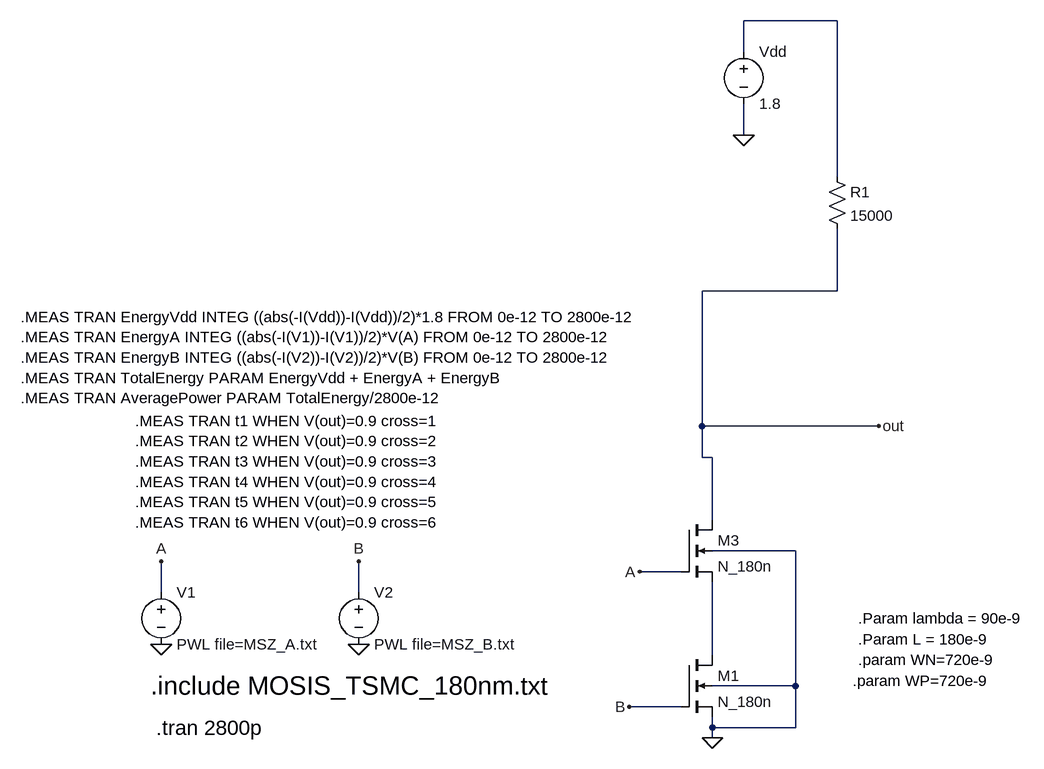
[diagram p0: schematic NAND2_180nm.asc]
NAND2_180nm.asc, the LTspice schematic file:
Version 4
SHEET 1 880 680
WIRE -912 -752 -1056 -752
WIRE -1056 -704 -1056 -752
WIRE -1056 -576 -1056 -624
WIRE -912 -512 -912 -752
WIRE -912 -336 -912 -432
WIRE -912 -336 -1120 -336
WIRE -1120 -128 -1120 -336
WIRE -848 -128 -1120 -128
WIRE -1120 -80 -1120 -128
WIRE -1104 -80 -1120 -80
WIRE -1104 16 -1104 -80
WIRE -976 64 -1104 64
WIRE -1152 96 -1216 96
WIRE -1952 128 -1952 80
WIRE -1648 128 -1648 80
WIRE -1104 224 -1104 112
WIRE -976 272 -976 64
WIRE -976 272 -1104 272
WIRE -1152 304 -1232 304
WIRE -1104 336 -1104 320
WIRE -976 336 -976 272
WIRE -976 336 -1104 336
WIRE -1104 352 -1104 336
FLAG -1952 208 0
FLAG -1648 208 0
FLAG -1952 80 A
FLAG -1648 80 B
FLAG -1104 352 0
FLAG -848 -128 out
FLAG -1232 304 B
FLAG -1216 96 A
FLAG -1056 -576 0
SYMBOL voltage -1952 112 R0
WINDOW 123 0 0 Left 0
WINDOW 39 0 0 Left 0
SYMATTR InstName V1
SYMATTR Value PWL file=MSZ_A.txt
SYMBOL voltage -1648 112 R0
WINDOW 123 0 0 Left 0
WINDOW 39 0 0 Left 0
SYMATTR InstName V2
SYMATTR Value PWL file=MSZ_B.txt
SYMBOL nmos4 -1152 224 R0
SYMATTR InstName M1
SYMATTR Value N_180n
SYMATTR Value2 l={L} w={WN} ad={5*lambda*WN} as={5*lambda*WN} pd={10*lambda + 2*WN} ps={10*lambda + 2*WN}
SYMBOL voltage -1056 -720 R0
SYMATTR InstName Vdd
SYMATTR Value 1.8
SYMBOL nmos4 -1152 16 R0
SYMATTR InstName M3
SYMATTR Value N_180n
SYMATTR Value2 l={L} w={WN} ad={5*lambda*WN} as={5*lambda*WN} pd={10*lambda + 2*WN} ps={10*lambda + 2*WN}
SYMBOL res -928 -528 R0
SYMATTR InstName R1
SYMATTR Value 15000
TEXT -1960 336 Left 3 !.tran 2800p
TEXT -1968 272 Left 4 !.include MOSIS_TSMC_180nm.txt
TEXT -880 168 Left 2 !.Param lambda = 90e-9
TEXT -880 200 Left 2 !.Param L = 180e-9
TEXT -880 232 Left 2 !.param WN=720e-9
TEXT -888 264 Left 2 !.param WP=720e-9
TEXT -1992 -136 Left 2 !.MEAS TRAN t1 WHEN V(out)=0.9 cross=1\n.MEAS TRAN t2 WHEN V(out)=0.9 cross=2\n.MEAS TRAN t3 WHEN V(out)=0.9 cross=3\n.MEAS TRAN t4 WHEN V(out)=0.9 cross=4\n.MEAS TRAN t5 WHEN V(out)=0.9 cross=5\n.MEAS TRAN t6 WHEN V(out)=0.9 cross=6
TEXT -2168 -296 Left 2 !.MEAS TRAN EnergyVdd INTEG ((abs(-I(Vdd))-I(Vdd))/2)*1.8 FROM 0e-12 TO 2800e-12\n.MEAS TRAN EnergyA INTEG ((abs(-I(V1))-I(V1))/2)*V(A) FROM 0e-12 TO 2800e-12\n.MEAS TRAN EnergyB INTEG ((abs(-I(V2))-I(V2))/2)*V(B) FROM 0e-12 TO 2800e-12\n.MEAS TRAN TotalEnergy PARAM EnergyVdd + EnergyA + EnergyB\n.MEAS TRAN AveragePower PARAM TotalEnergy/2800e-12

The netlist it stands for:
* NAND2_180nm.asc
V1 A 0 PWL file=MSZ_A.txt
V2 B 0 PWL file=MSZ_B.txt
M1 N002 B 0 0 N_180n l={L} w={WN} ad={5*lambda*WN} as={5*lambda*WN} pd={10*lambda + 2*WN} ps={10*lambda + 2*WN}
Vdd N001 0 1.8
M3 out A N002 0 N_180n l={L} w={WN} ad={5*lambda*WN} as={5*lambda*WN} pd={10*lambda + 2*WN} ps={10*lambda + 2*WN}
R1 N001 out 15000
.model NMOS NMOS
.model PMOS PMOS
.lib standard.mos
.tran 2800p
.include MOSIS_TSMC_180nm.txt
.Param lambda = 90e-9
.Param L = 180e-9
.param WN=720e-9
.param WP=720e-9
.MEAS TRAN t1 WHEN V(out)=0.9 cross=1
.MEAS TRAN t2 WHEN V(out)=0.9 cross=2
.MEAS TRAN t3 WHEN V(out)=0.9 cross=3
.MEAS TRAN t4 WHEN V(out)=0.9 cross=4
.MEAS TRAN t5 WHEN V(out)=0.9 cross=5
.MEAS TRAN t6 WHEN V(out)=0.9 cross=6
.MEAS TRAN EnergyVdd INTEG ((abs(-I(Vdd))-I(Vdd))/2)*1.8 FROM 0e-12 TO 2800e-12
.MEAS TRAN EnergyA INTEG ((abs(-I(V1))-I(V1))/2)*V(A) FROM 0e-12 TO 2800e-12
.MEAS TRAN EnergyB INTEG ((abs(-I(V2))-I(V2))/2)*V(B) FROM 0e-12 TO 2800e-12
.MEAS TRAN TotalEnergy PARAM EnergyVdd + EnergyA + EnergyB
.MEAS TRAN AveragePower PARAM TotalEnergy/2800e-12
.backanno
.end

* Results of the author's LTspice run, read from the files saved beside the schematic
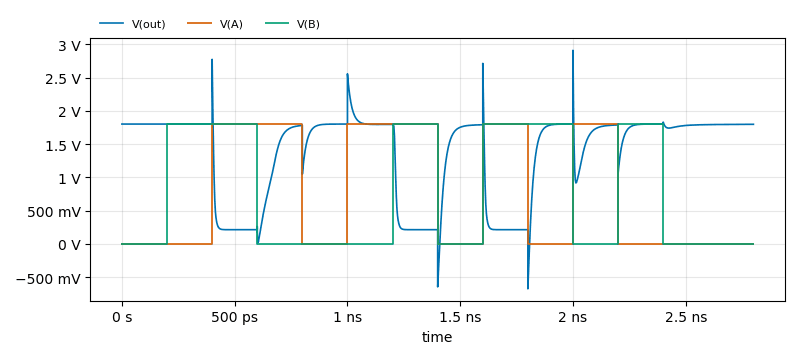
[diagram p1: Transient Analysis of NAND2_180nm.asc, plotted from the saved traces]
* Transient Analysis, 1 run:
*   V(out): min -676.8 mV, max 2.908 V, average 1.38 V, rms 1.529 V, last 1.796 V
*   V(A): min 0 V, max 1.8 V, average 771.4 mV, rms 1.178 V, last 0 V
*   V(B): min 0 V, max 1.8 V, average 771.4 mV, rms 1.178 V, last 0 V